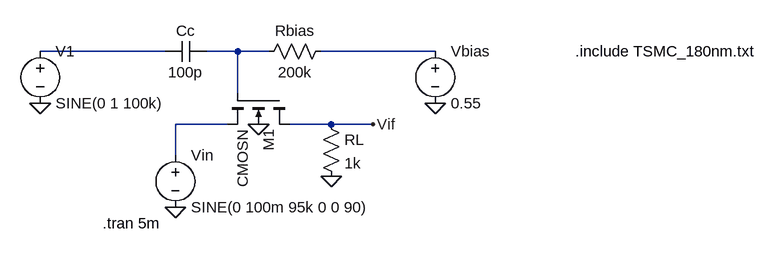
[diagram p0: schematic MIXER_AEC_PROJECT.asc]
MIXER_AEC_PROJECT.asc, the LTspice schematic file:
Version 4.1
SHEET 1 996 680
WIRE 64 64 -128 64
WIRE 176 64 128 64
WIRE 224 64 176 64
WIRE 480 64 304 64
WIRE 176 128 176 64
WIRE 160 176 80 176
WIRE 320 176 256 176
WIRE 384 176 320 176
WIRE 80 224 80 176
FLAG 208 176 0
FLAG 80 304 0
FLAG 384 176 Vif
FLAG 320 256 0
FLAG 480 144 0
FLAG -128 144 0
SYMBOL nmos4 256 128 R90
SYMATTR InstName M1
SYMATTR Value CMOSN
SYMATTR Value2 l=0.18u w=1.8u ad=0.81e-12 as=0.81e-12 pd=9.36u ps=9.36
SYMBOL cap 128 48 R90
WINDOW 0 0 32 VBottom 2
WINDOW 3 32 32 VTop 2
SYMATTR InstName Cc
SYMATTR Value 100p
SYMBOL voltage 80 208 R0
WINDOW 123 0 0 Left 0
WINDOW 39 0 0 Left 0
SYMATTR InstName Vin
SYMATTR Value SINE(0 100m 95k 0 0 90)
SYMBOL res 304 160 R0
SYMATTR InstName RL
SYMATTR Value 1k
SYMBOL res 320 48 R90
WINDOW 0 0 56 VBottom 2
WINDOW 3 32 56 VTop 2
SYMATTR InstName Rbias
SYMATTR Value 200k
SYMBOL voltage 480 48 R0
WINDOW 123 0 0 Left 0
WINDOW 39 0 0 Left 0
SYMATTR InstName Vbias
SYMATTR Value 0.55
SYMBOL voltage -128 48 R0
WINDOW 123 0 0 Left 0
WINDOW 39 0 0 Left 0
SYMATTR InstName V1
SYMATTR Value SINE(0 1 100k)
TEXT -32 328 Left 2 !.tran 5m
TEXT 696 64 Left 2 !.include TSMC_180nm.txt

The netlist it stands for:
* MIXER_AEC_PROJECT.asc
M1 Vif N002 N004 0 CMOSN l=0.18u w=1.8u ad=0.81e-12 as=0.81e-12 pd=9.36u ps=9.36
Cc N002 N001 100p
Vin N004 0 SINE(0 100m 95k 0 0 90)
RL Vif 0 1k
Rbias N003 N002 200k
Vbias N003 0 0.55
V1 N001 0 SINE(0 1 100k)
.model NMOS NMOS
.model PMOS PMOS
.lib standard.mos
.tran 5m
.include TSMC_180nm.txt
.backanno
.end